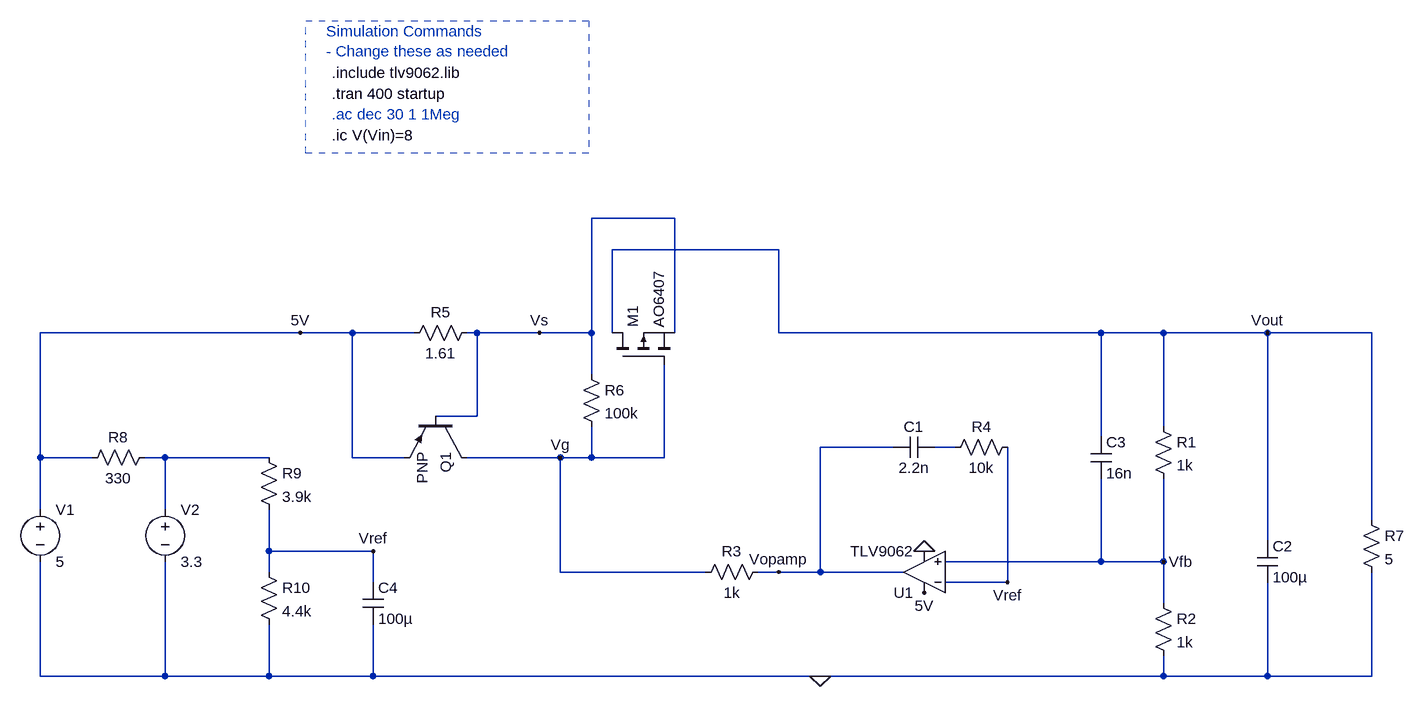
[diagram p0: schematic LTspice draft - Copy.asc]
LTspice draft - Copy.asc, the LTspice schematic file:
Version 4.1
SHEET 1 2392 1416
WIRE 192 -800 64 -800
WIRE 352 -752 96 -752
WIRE -384 -624 -784 -624
WIRE -304 -624 -384 -624
WIRE -208 -624 -304 -624
WIRE -112 -624 -128 -624
WIRE -16 -624 -112 -624
WIRE 64 -624 64 -800
WIRE 64 -624 -16 -624
WIRE 96 -624 96 -752
WIRE 192 -624 192 -800
WIRE 352 -624 352 -752
WIRE 848 -624 352 -624
WIRE 944 -624 848 -624
WIRE 1104 -624 944 -624
WIRE 1264 -624 1104 -624
WIRE 64 -560 64 -624
WIRE -112 -496 -112 -624
WIRE -112 -496 -176 -496
WIRE 944 -480 944 -624
WIRE 848 -464 848 -624
WIRE 528 -448 416 -448
WIRE 624 -448 592 -448
WIRE -784 -432 -784 -624
WIRE -704 -432 -784 -432
WIRE -592 -432 -624 -432
WIRE -432 -432 -592 -432
WIRE -304 -432 -304 -624
WIRE -224 -432 -304 -432
WIRE 16 -432 -128 -432
WIRE 64 -432 64 -480
WIRE 64 -432 16 -432
WIRE 176 -432 176 -576
WIRE 176 -432 64 -432
WIRE -784 -352 -784 -432
WIRE -592 -352 -592 -432
WIRE 1264 -336 1264 -624
WIRE 1104 -304 1104 -624
WIRE -432 -288 -432 -352
WIRE -272 -288 -432 -288
WIRE 848 -272 848 -400
WIRE 848 -272 608 -272
WIRE 944 -272 944 -400
WIRE 944 -272 848 -272
WIRE -432 -256 -432 -288
WIRE 16 -256 16 -432
WIRE 240 -256 16 -256
WIRE 352 -256 320 -256
WIRE 416 -256 416 -448
WIRE 416 -256 352 -256
WIRE 544 -256 416 -256
WIRE -272 -240 -272 -288
WIRE 704 -240 704 -448
WIRE 704 -240 608 -240
WIRE 944 -208 944 -272
WIRE -784 -96 -784 -272
WIRE -592 -96 -592 -272
WIRE -592 -96 -784 -96
WIRE -432 -96 -432 -176
WIRE -432 -96 -592 -96
WIRE -272 -96 -272 -176
WIRE -272 -96 -432 -96
WIRE 416 -96 -272 -96
WIRE 944 -96 944 -128
WIRE 944 -96 416 -96
WIRE 1104 -96 1104 -240
WIRE 1104 -96 944 -96
WIRE 1264 -96 1264 -256
WIRE 1264 -96 1104 -96
FLAG 576 -288 0
FLAG 576 -224 5V
FLAG 416 -96 0
FLAG -384 -624 5V
FLAG 704 -240 Vref
FLAG 1104 -624 Vout
FLAG 944 -272 Vfb
FLAG 352 -256 Vopamp
FLAG 16 -432 Vg
FLAG -16 -624 Vs
FLAG -272 -288 Vref
SYMBOL res 928 -496 R0
SYMATTR InstName R1
SYMATTR Value 1k
SYMBOL res 928 -224 R0
SYMATTR InstName R2
SYMATTR Value 1k
SYMBOL pnp2 -128 -496 R90
SYMATTR InstName Q1
SYMBOL res -112 -640 R90
WINDOW 0 0 56 VBottom 2
WINDOW 3 32 56 VTop 2
SYMATTR InstName R5
SYMATTR Value 1.61
SYMBOL voltage -784 -368 R0
WINDOW 123 0 0 Left 0
WINDOW 39 0 0 Left 0
SYMATTR InstName V1
SYMATTR Value 5
SYMBOL pmos 96 -576 R270
SYMATTR InstName M1
SYMATTR Value AO6407
SYMBOL res 48 -576 R0
SYMATTR InstName R6
SYMATTR Value 100k
SYMBOL cap 1088 -304 R0
SYMATTR InstName C2
SYMATTR Value 100µ
SYMBOL cap 832 -464 R0
SYMATTR InstName C3
SYMATTR Value 16n
SYMBOL res 336 -272 R90
WINDOW 0 0 56 VBottom 2
WINDOW 3 32 56 VTop 2
SYMATTR InstName R3
SYMATTR Value 1k
SYMBOL cap 592 -464 R90
WINDOW 0 0 32 VBottom 2
WINDOW 3 32 32 VTop 2
SYMATTR InstName C1
SYMATTR Value 2.2n
SYMBOL res 720 -464 R90
WINDOW 0 0 56 VBottom 2
WINDOW 3 32 56 VTop 2
SYMATTR InstName R4
SYMATTR Value 10k
SYMBOL res -608 -448 R90
WINDOW 0 0 56 VBottom 2
WINDOW 3 32 56 VTop 2
SYMATTR InstName R8
SYMATTR Value 330
SYMBOL voltage -592 -368 R0
WINDOW 123 0 0 Left 0
WINDOW 39 0 0 Left 0
SYMATTR InstName V2
SYMATTR Value 3.3
SYMBOL res -448 -448 R0
SYMATTR InstName R9
SYMATTR Value 3.9k
SYMBOL res -448 -272 R0
SYMATTR InstName R10
SYMATTR Value 4.4k
SYMBOL cap -288 -240 R0
SYMATTR InstName C4
SYMATTR Value 100µ
SYMBOL res 1248 -352 R0
SYMATTR InstName R7
SYMATTR Value 5
SYMBOL OpAmps\\opamp2 576 -192 R180
SYMATTR InstName U1
SYMATTR Value TLV9062
TEXT -336 -960 Left 2 ;.ac dec 30 1 1Meg
TEXT -336 -1024 Left 2 !.include tlv9062.lib
TEXT -344 -1088 Left 2 ;Simulation Commands\n- Change these as needed
TEXT -336 -992 Left 2 !.tran 400 startup
TEXT -336 -928 Left 2 !.ic V(Vin)=8
RECTANGLE Normal -376 -1104 60 -900 2

The netlist it stands for:
* LTspice draft - Copy.asc
R1 Vout Vfb 1k
R2 Vfb 0 1k
Q1 Vg Vs 5V 0 PNP
R5 Vs 5V 1.61
V1 5V 0 5
M1 Vout Vg Vs Vs AO6407
R6 Vs Vg 100k
C2 Vout 0 100µ
C3 Vout Vfb 16n
R3 Vopamp Vg 1k
C1 N001 Vopamp 2.2n
R4 Vref N001 10k
R8 N002 5V 330
V2 N002 0 3.3
R9 N002 Vref 3.9k
R10 Vref 0 4.4k
C4 Vref 0 100µ
R7 Vout 0 5
X§U1 Vfb Vref 5V 0 Vopamp TLV9062  ; pins In+ In- V+ V- OUT
.model NPN NPN
.model PNP PNP
.lib standard.bjt
.model NMOS NMOS
.model PMOS PMOS
.lib standard.mos
* .ac dec 30 1 1Meg
.include tlv9062.lib
* Simulation Commands
* - Change these as needed
.tran 400 startup
.ic V(Vin)=8
.backanno
.end